# Altium schematic sheet Power_HST.SchDoc
size Tabloid
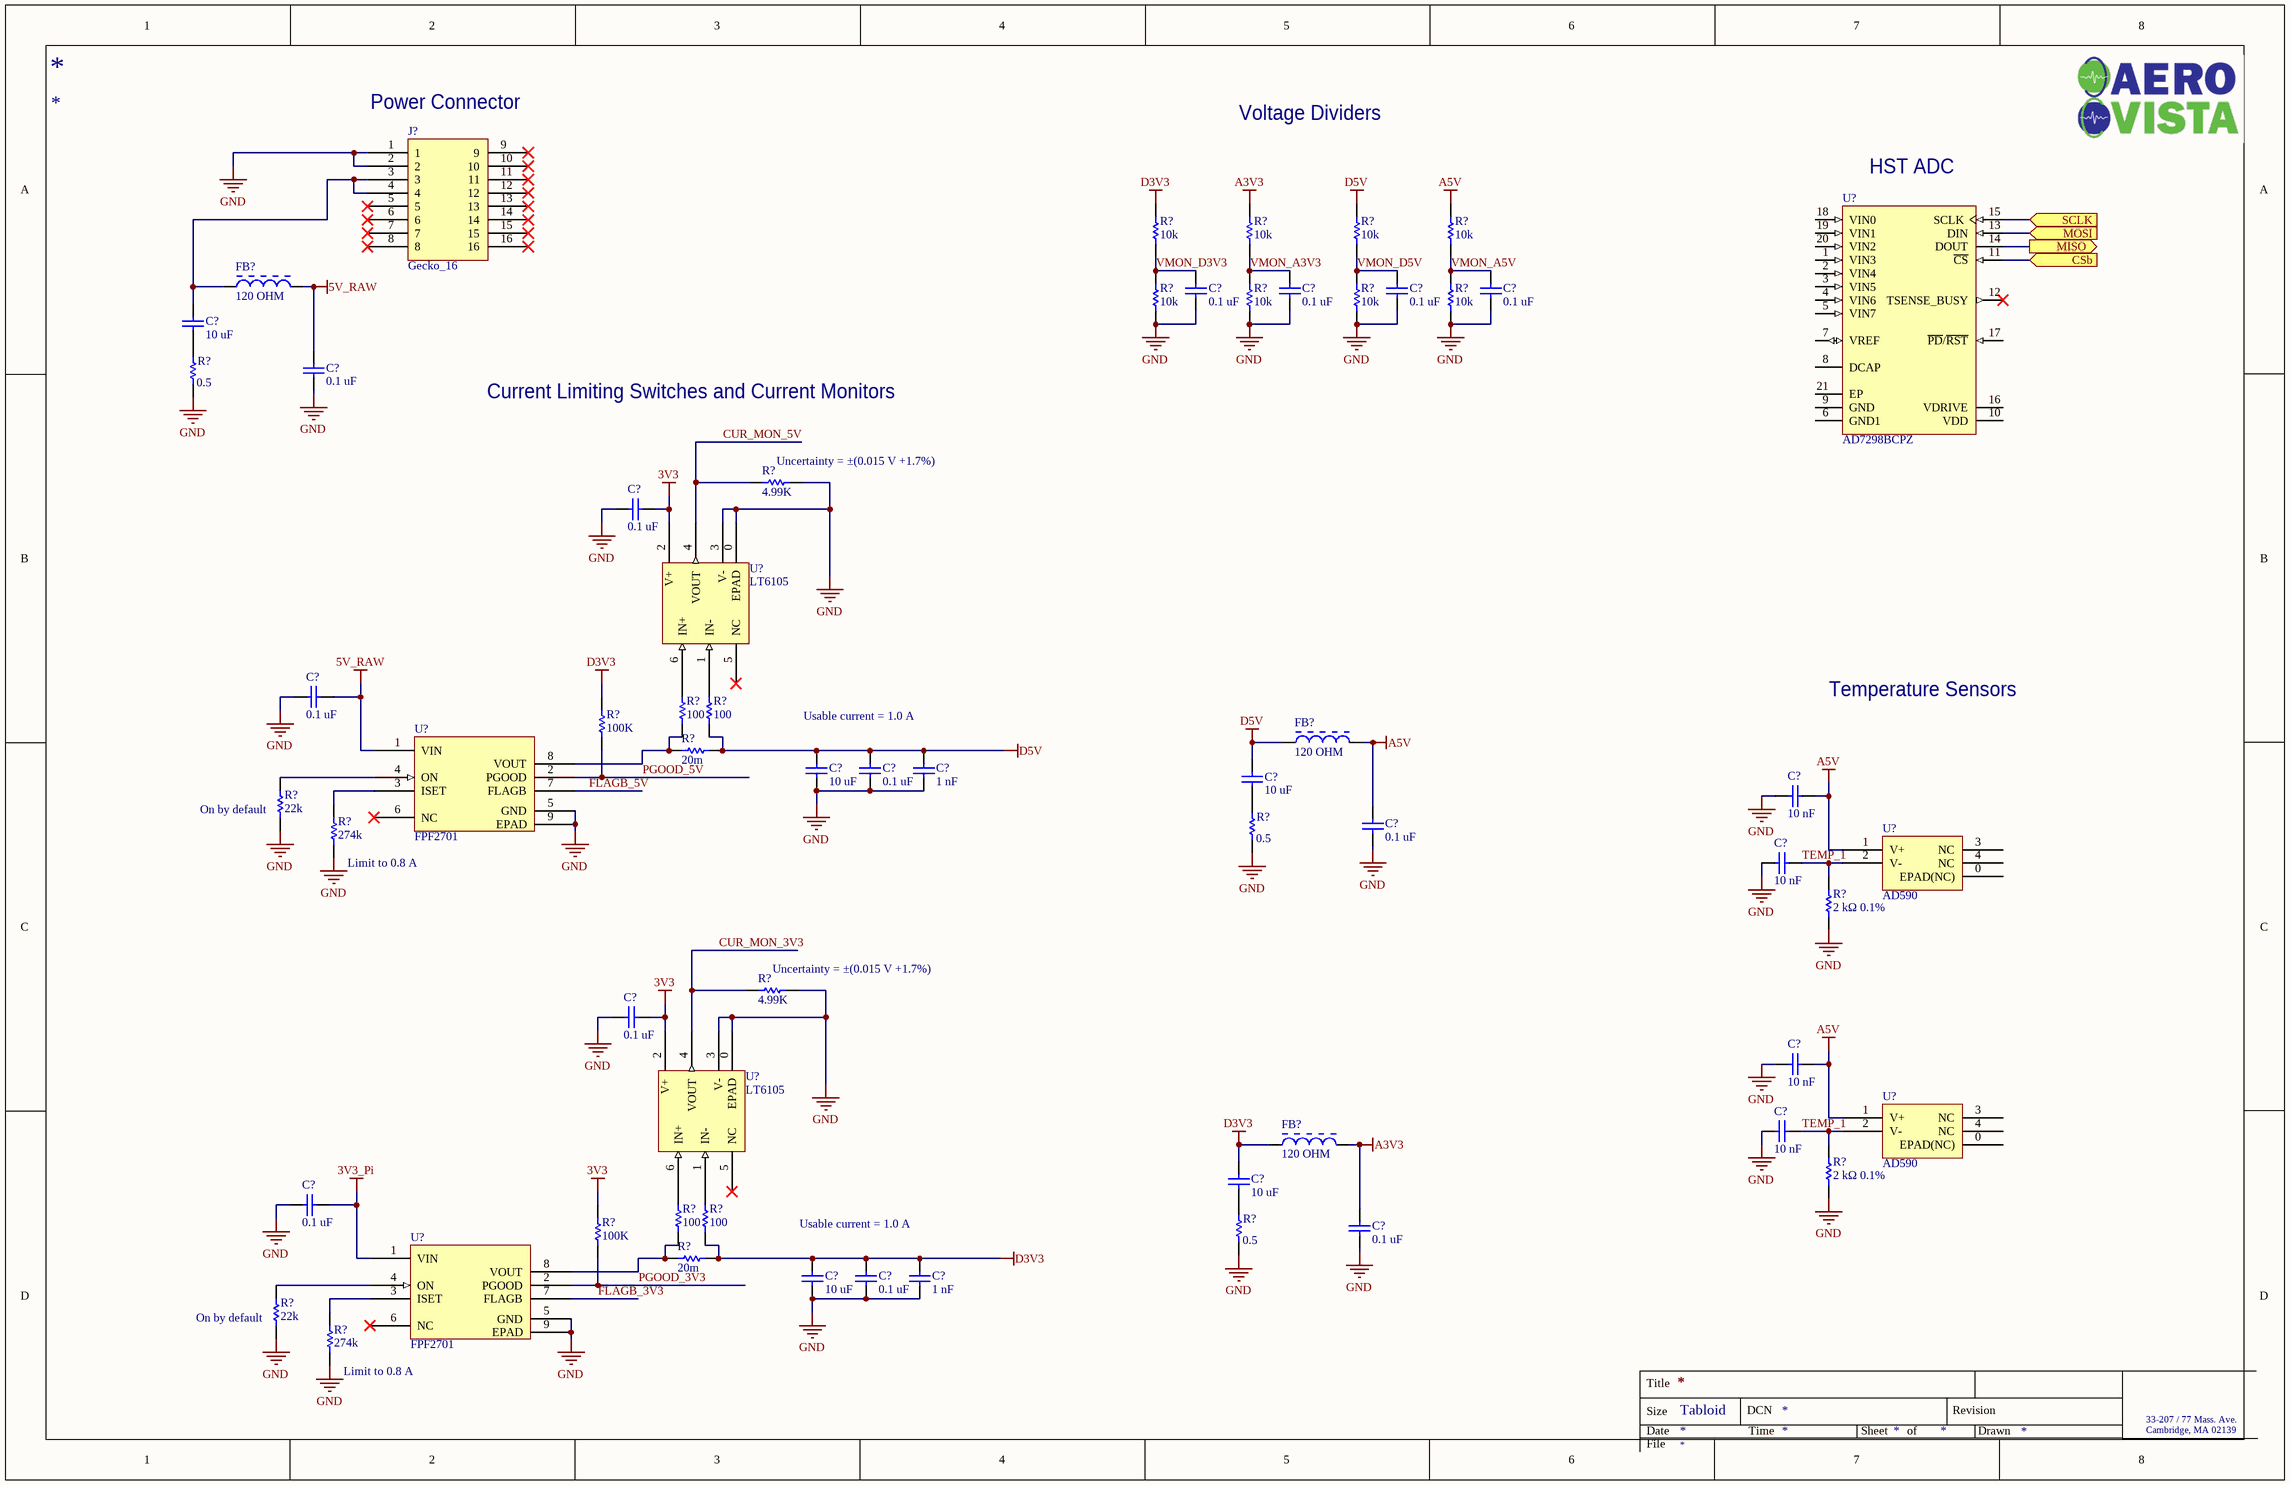
[diagram p0: Power_HST.SchDoc]

## Parts
(Parts that share a designator on the sheet are numbered #1, #2 ... from top to bottom, then left to right.)
C?#1  0.1 uF  [CAPC1005X55X25LL05T10]
C?#2  0.1 uF  [CAPC1005X55X25LL05T10]
C?#3  0.1 uF  [CAPC1005X55X25LL05T10]
C?#4  0.1 uF  [CAPC1005X55X25LL05T10]
C?#5  10 uF  [CAPC1608X90X20LL10]
C?#6  0.1 uF  [CAPC1005X55X25LL05T10]
C?#7  0.1 uF  [CAPC1005X55X25LL05T10]
C?#8  0.1 uF  [CAPC1005X55X25LL05T10]
C?#9  1 nF  [CAPC1005X55X30LL05T10]
C?#10  10 nF  [CAPC1005X56X25NL10T15]
C?#11  10 uF  [CAPC1608X90X20LL10]
C?#12  0.1 uF  [CAPC1005X55X25LL05T10]
C?#13  10 uF  [CAPC1608X90X20LL10]
C?#14  0.1 uF  [CAPC1005X55X25LL05T10]
C?#15  10 nF  [CAPC1005X56X25NL10T15]
C?#16  0.1 uF  [CAPC1005X55X25LL05T10]
C?#17  10 nF  [CAPC1005X56X25NL10T15]
C?#18  10 nF  [CAPC1005X56X25NL10T15]
C?#19  10 uF  [CAPC1608X90X20LL10]
C?#20  0.1 uF  [CAPC1005X55X25LL05T10]
C?#21  0.1 uF  [CAPC1005X55X25LL05T10]
C?#22  1 nF  [CAPC1005X55X30LL05T10]
C?#23  10 uF  [CAPC1608X90X20LL10]
C?#24  0.1 uF  [CAPC1005X55X25LL05T10]
FB?#1  120 OHM  [MURA-BLM21-H1-CHIP-2_V]
FB?#2  120 OHM  [MURA-BLM21-H1-CHIP-2_V]
FB?#3  120 OHM  [MURA-BLM21-H1-CHIP-2_V]
J?  Gecko_16
R?#1  10k  [RESC1005X40X25LL05T05]
R?#2  10k  [RESC1005X40X25LL05T05]
R?#3  10k  [RESC1005X40X25LL05T05]
R?#4  10k  [RESC1005X40X25LL05T05]
R?#5  10k  [RESC1005X40X25LL05T05]
R?#6  10k  [RESC1005X40X25LL05T05]
R?#7  10k  [RESC1005X40X25LL05T05]
R?#8  10k  [RESC1005X40X25LL05T05]
R?#9  0.5  [RESC1005X40X25LL10T10]
R?#10  4.99K  [RESC1005X40X25LL05T05]
R?#11  100  [RESC0402(1005)_L]
R?#12  100  [RESC0402(1005)_L]
R?#13  100K  [RESC1005X40X25LL05T05]
R?#14  20m  [RESC1608X55X25LL10T15]
R?#15  22k  [RESC1005X40X25LL05T05]
R?#16  0.5  [RESC1005X40X25LL10T10]
R?#17  274k  [RESC1005X40X25NL05T05]
R?#18  2 kΩ 0.1%  [RESC1005X40X25LL10T10]
R?#19  4.99K  [RESC1005X40X25LL05T05]
R?#20  2 kΩ 0.1%  [RESC1005X40X25LL10T10]
R?#21  100  [RESC0402(1005)_L]
R?#22  100  [RESC0402(1005)_L]
R?#23  0.5  [RESC1005X40X25LL10T10]
R?#24  100K  [RESC1005X40X25LL05T05]
R?#25  20m  [RESC1608X55X25LL10T15]
R?#26  22k  [RESC1005X40X25LL05T05]
R?#27  274k  [RESC1005X40X25NL05T05]
U?#1  AD7298BCPZ  [CP-20-8_M]
U?#2  LT6105  [QFN50P300X200X80_HS-7N]
U?#3  FPF2701  [QFN65P300X300X80_HS-9N]
U?#4  AD590
U?#5  AD590
U?#6  LT6105  [QFN50P300X200X80_HS-7N]
U?#7  FPF2701  [QFN65P300X300X80_HS-9N]

## Ports
CSb (in), MISO (out), MOSI (in), SCLK (in)

## Nets
3V3: C?#7.2 C?#16.2 R?#24.2 U?#2.2(V+) U?#6.2(V+)
3V3_Pi: C?#20.2 U?#7.1(VIN)
5V_RAW: C?#6.2 C?#8.2 FB?#1.2 U?#3.1(VIN)
A3V3: C?#21.2 FB?#3.2 R?#2.2
A5V: C?#10.2 C?#14.2 C?#17.2 FB?#2.2 R?#4.2 U?#4.1(V+) U?#5.1(V+)
D3V3: C?#19.2 C?#22.2 C?#23.2 C?#24.2 FB?#3.1 R?#1.2 R?#13.2 R?#22.1 R?#25.2
D5V: C?#9.2 C?#11.2 C?#12.2 C?#13.2 FB?#2.1 R?#3.2 R?#12.1 R?#14.2
GND: C?#1.1 C?#2.1 C?#3.1 C?#4.1 C?#6.1 C?#7.1 C?#8.1 C?#9.1 C?#10.1 C?#11.1 C?#12.1 C?#14.1 C?#15.1 C?#16.1 C?#17.1 C?#18.1 C?#20.1 C?#21.1 C?#22.1 C?#23.1 C?#24.1 J?.1 J?.2 R?#5.1 R?#6.1 R?#7.1 R?#8.1 R?#9.1 R?#10.2 R?#15.1 R?#16.1 R?#17.1 R?#18.1 R?#19.2 R?#20.1 R?#23.1 R?#26.1 R?#27.1 U?#2.0(EPAD) U?#2.3(V-) U?#3.5(GND) U?#3.9(EPAD) U?#6.0(EPAD) U?#6.3(V-) U?#7.5(GND) U?#7.9(EPAD)
CSb: U?#1.11(~{CS}) ; port CSb
CUR_MON_3V3: R?#19.1 U?#6.4(VOUT)
CUR_MON_5V: R?#10.1 U?#2.4(VOUT)
FLAGB_3V3: U?#7.7(FLAGB)
FLAGB_5V: U?#3.7(FLAGB)
MISO: U?#1.14(DOUT) ; port MISO
MOSI: U?#1.13(DIN) ; port MOSI
PGOOD_3V3: R?#24.1 U?#7.2(PGOOD)
PGOOD_5V: R?#13.1 U?#3.2(PGOOD)
SCLK: U?#1.15(SCLK) ; port SCLK
TEMP_1: C?#15.2 C?#18.2 R?#18.2 R?#20.2 U?#4.2(V-) U?#5.2(V-)
VMON_A3V3: C?#2.2 R?#2.1 R?#6.2
VMON_A5V: C?#4.2 R?#4.1 R?#8.2
VMON_D3V3: C?#1.2 R?#1.1 R?#5.2
VMON_D5V: C?#3.2 R?#3.1 R?#7.2
NetC?#5_1: C?#5.1 R?#9.2
NetC?#5_2: C?#5.2 FB?#1.1 J?.3 J?.4
NetC?#13_1: C?#13.1 R?#16.2
NetC?#19_1: C?#19.1 R?#23.2
NetR?#11_1: R?#11.1 R?#14.1 U?#3.8(VOUT)
NetR?#11_2: R?#11.2 U?#2.6(IN+)
NetR?#12_2: R?#12.2 U?#2.1(IN-)
NetR?#15_2: R?#15.2 U?#3.4(ON)
NetR?#17_2: R?#17.2 U?#3.3(ISET)
NetR?#21_1: R?#21.1 R?#25.1 U?#7.8(VOUT)
NetR?#21_2: R?#21.2 U?#6.6(IN+)
NetR?#22_2: R?#22.2 U?#6.1(IN-)
NetR?#26_2: R?#26.2 U?#7.4(ON)
NetR?#27_2: R?#27.2 U?#7.3(ISET)

Not connected (* = marked no-connect by the designer): J? 5* 6* 7* 8* 9* 10* 11* 12* 13* 14* 15* 16*; U?#1 1(VIN3) 2(VIN4) 3(VIN5) 4(VIN6) 5(VIN7) 6(GND1) 7(VREF) 8(DCAP) 9(GND) 10(VDD) 12(TSENSE_BUSY)* 16(VDRIVE) 17(~{PD}/~{RST}) 18(VIN0) 19(VIN1) 20(VIN2) 21(EP); U?#2 5(NC)*; U?#3 6(NC)*; U?#4 0(EPAD(NC)) 3(NC) 4(NC); U?#5 0(EPAD(NC)) 3(NC) 4(NC); U?#6 5(NC)*; U?#7 6(NC)*

## Notes on the sheet
- (near J?) Power Connector
- Voltage Dividers
- (near U?#1) HST ADC
- Current Limiting Switches and Current Monitors
- (near R?#10) Uncertainty = ±(0.015 V +1.7%)
- Temperature Sensors
- (near C?#11) Usable current = 1.0 A
- (near R?#15) On by default
- (near R?#17) Limit to 0.8 A
- (near R?#19) Uncertainty = ±(0.015 V +1.7%)
- (near C?#23) Usable current = 1.0 A
- (near R?#26) On by default
- (near R?#27) Limit to 0.8 A
- Title
- Size
- Date
- Tabloid
- DCN
- Time
- Sheet
- of
- Revision
- Drawn
- 33-207 / 77 Mass. Ave.
- Cambridge, MA 02139
- File

## Library data of the parts
C?#1-C?#4 C?#6-C?#8 C?#12 C?#14 C?#16 C?#20 C?#21 C?#24 = CMP-2100-03641-1: Chip Capacitor, 0.1 uF, +/- 10%, 16 V, -55 to 125 degC, 0402 (1005 Metric), RoHS, Tape and Reel; Manufacturer: Murata; Material: Ceramic; Insulation Resistance: 10GR; Voltage: 16V; Dielectric: X7R; Capacitance: 100nF; REACH SVHC: NoSVHC; Depth: 0.5mm; Case/Package: 0402; Datasheet URL: http://psearch.en.murata.com/capacitor/product/GRM155R71C104KA88%23.pdf; Lead Free: LeadFree; Dielectric Material: Ceramic; Manufacturer URL: http://www.murata.com/; Min Operating Temperature: -55degC; Length: 1mm; Case Code (Metric): 1005; Radiation Hardening: No; Package Reference: 0402; RoHSCompliant: true; Datasheet Version: 42675.0; Thickness: 0.022inch; Packaging: TapeandReel; Voltage Rating (DC): 16V; Tolerance: 10%; Max Operating Temperature: 125degC; Package Description: 2-Pin Surface Mount Device, Body 1 x 0.5 mm; Mount: SurfaceMount; Height: 0.5mm; Width: 0.5mm; Number of Pins: 2; Voltage Rating: 16V; Case Code (Imperial): 0402; Termination: SMD/SMT; Package Quantity: 1
C?#5 C?#11 C?#13 C?#19 C?#23 = CMP-2000-04979-1: Chip Capacitor, 10 uF, +/- 10%, 10 V, -55 to 85 degC, 0603 (1608 Metric), RoHS, Tape and Reel; PCN Part Number: MLCCPartNumberChange30/Nov/2012; Manufacturer: TDK; Temperature Coefficient: X5R; Product Training Modules: CSeriesGeneralApplicationsSEAT,CCV,andTVCLDesignToolsGuidetoReplacinganElectrolyticCapacitorwithanMLCC; Online Catalog: CSeries,GeneralPurpose; Voltage - Rated: 10V; Other Names: 445-7486-1; Capacitance: 10µF; Design Resources: 20WNon-IsolatedBuckLEDDriverUsingPLLNK460KG; Kits: 445-9003-KIT-ND-KITCAPCERHICAPMLCCSMD; Height - Seated (Max): -; Family: CeramicCapacitors; Package Description: 2-Pin Surface Mount Device, Body 1.6 x 0.8 mm; Category: Capacitors; Datasheet Version: Mar-15; RoHS Information: RoHSCertificate-MLCC; Thickness (Max): 0.035"(0.90mm); Operating Temperature: -55degC~85degC; Package Reference: 603; Series: C; Applications: GeneralPurpose; Datasheet URL: http://download.siliconexpert.com/pdfs/2015/4/21/15/54/45/779/tdk_/manual/37024850441143360mlcc_commercial_general_en.pdf; Features: -; Lead Style: -; Lead Spacing: -; Ratings: -; Size / Dimension: 0.063"Lx0.031"W(1.60mmx0.80mm); Tolerance: ±10%; Mounting Type: SurfaceMount,MLCC; Standard Package: 1; Package / Case: 0603(1608Metric); Manufacturer URL: http://www.tdk.com/; Packaging: CutTape(CT)
C?#9 C?#22 = CMP-2008-03058-1: Part Number: C0402C102K4RACTU; Manufacturer: Kemet
C?#10 C?#15 C?#17 C?#18 = CMP-2008-02912-1: Part Number: 0402ZC103KAT2A; Manufacturer: AVX Interconnect / Elco; Capacitance: 10 nF
FB?#1-FB?#3 = CMP-0686-00716-2: Chip Ferrite Bead for General Signal lines, 120 Ohm, 800 mA, -55 to 125 degC, 2 x 1.25 x 1.05 mm SMD, Tape and Reel; PartNumber: BLM21AG121SN1D; Manufacturer: Murata; Rated Current: 800 mA; DC Resistance: 0.1 Ohm Max.; Impedance (at 100 MHz): 120 Ohm +/- 25%; DatasheetVersion: 08/2013; PackageReference: BLM21_H1050-2; ComponentLink3URL: http://www.murata.com/products/catalog/pdf/c31e.pdf; Mounting Technology: Surface Mount; Operating Temperature Range: -55 to 125 degC; ComponentLink2Description: Datasheet; ComponentLink1URL: http://www.murata.com/; ComponentLink3Description: Package Specification; Packing: Tape and Reel; ComponentLink2URL: http://www.murata.com/products/catalog/pdf/c31e.pdf; PackageDescription: 2-Pin Chip, Body 2 x 1.25 mm; ComponentLink1Description: Manufacturer URL
R?#1-R?#8 = CMP-2002-08135-1: Manufacturer: Vishay Dale; Part Number: CRCW040210K0FKED
R?#9 R?#16 R?#23 = CMP-2002-06398-1: Part Number: RL0402FR-070R5L; Manufacturer: Yageo
R?#10 R?#19 = CMP-2002-00966-3: Chip Resistor, 4.99 KOhm, +/- 1%, 100 mW, -55 to 155 degC, 0402 (1005 Metric), RoHS, Tape and Reel; Manufacturer: Basic Passives; PartNumber: ERJ-2RKF4991X; Power Rating: 100 mW; Case\/Package: 0402; Voltage Rating: 50 V; REACH SVHC: Unknown; PackageDescription: 2-Pin Surface Mount Device, Body 1 x 0.5 mm; Mounting Technology: Surface Mount; ComponentLink2URL: http://industrial.panasonic.com/cdbs/www-data/pdf/RDA0000/AOA0000C86.pdf; Packaging: Tape and Reel; Case Code (Imperial): 0402; PackageReference: 0402; Min Operating Temperature: -55 degC; ComponentLink1URL: http://www.panasonic.com/; Width: 0.5 mm; Mount: Surface Mount; Max Operating Temperature: 155 degC; Radiation Hardening: No; Resistance: 4.99 KOhm; ComponentLink1Description: Manufacturer URL; Case Code (Metric): 1005; Pins: 2; Package Quantity: 10000; DatasheetVersion: 04/2015; ComponentLink2Description: Datasheet; Weight: 2.8E-05oz; Length: 1 mm; Tolerance: 1%; RoHSCompliant: true; Height: 0.35 mm
R?#11 R?#12 R?#21 R?#22 = CMP-1011-00397-1: 100R 0.063W 1% 0402 (1005 Metric)  SMD; Case-EIA: 0402; Case-Metric: 1005; Value: 100.00 Ohm; Technology: SMT; Tolerance: 1 %; Power: 0.063 W
R?#13 R?#24 = CMP-2002-08123-2: Chip Resistor, 100 KOhm, +/- 1%, 0.63 W, -55 to 155 degC, 0402 (1005 Metric), RoHS, Tape and Reel; Voltage Rating: 50 V; Type (Resistor): Thick Film; Power Rating: 63 mW; Case\Package: 0402; Mount: Surface Mount; Packaging: Tape and Reel; Weight: 2.3E-05 oz; PackageDescription: 2-Pin Surface Mount Device, Body 1 x 0.5 mm; ComponentLink1Description: Manufacturer URL; ComponentLink2Description: Datasheet; Min Operating Temperature: -55 degC; Width: 0.5 mm; Resistance: 100 kohm; REACH SVHC: Unknown; ComponentLink2URL: http://www.vishay.com/docs/20035/dcrcwe3.pdf; Package Quantity: 10000; Mounting Technology: Surface Mount; PackageReference: 0402; ComponentLink1URL: http://www.vishay.com/; Max Operating Temperature: 155 degC; Length: 1 mm; DatasheetVersion: 06/2012; Height: 0.35 mm; Case Code (Imperial): 0402; Pins: 2; Tolerance: 1%; Case Code (Metric): 1005; Radiation Hardening: No; RoHSCompliant: true
R?#14 R?#25 = CMP-2000-04331-1: Manufacturer: Yageo; Part Number: RL0603FR-070R02L
R?#15 R?#26 = CMP-2002-01133-1: Part Number: ERJ2RKF2202X; Manufacturer: Panasonic
R?#17 R?#27 = CMP-2002-08429-1: Part Number: CRCW0402274KFKED; Manufacturer: Vishay Dale
R?#18 R?#20 = CMP-2002-05790-1: Manufacturer: Panasonic; Part Number: ERA-2AEB202X; Resistance: 2 kΩ 0.1%
U?#1 = CMP-0313-00349-2: 8 Channel 12-Bit SAR Analog-to-Digital Converter with SPI Interface and Temperature Sensor 1MSPS, -40 to +125 degC, CP-20-8, Pb-Free, Tray; Manufacturer: Analog Devices; Generic Part Number: AD7298; Resolution (Bits): 12; Throughput Rate (SPS): 1M; Channels: 9; ComponentLink3URL: http://www.analog.com/static/imported-files/packages/PKG_PDF/LFCSP(CP)/CP-20/CP_20_8.pdf; PackageDescription: 20-Lead Lead Frame Chip Scale Package [LFCSP_WQ] 4 x 4 mm Body, Very Very Thin Quad; ComponentLink2URL: http://www.analog.com/static/imported-files/data_sheets/AD7298.pdf; Packing: Tray; PartNumber: AD7298BCPZ; ComponentLink4URL: http://www.analog.com/en/analog-to-digital-converters/ad-converters/ad7298/products/product.html; RoHS: Y; PackageReference: CP-20-8; PackageVersion: 020509-B; Mounting Technology: Surface Mount; ComponentLink3Description: Package Specification; DatasheetVersion: Rev.B; Code_JEDEC: MO-220-WGGD; ComponentLink2Description: Datasheet; ComponentLink4Description: Product URL; ComponentLink1Description: Manufacturer URL; ComponentLink1URL: http://www.analog.com/en/index.html; Interface: SPI
U?#3 U?#7 = FPF2701: Manufacturer 1: ON Semiconductor / Fairchild; Manufacturer Part Number 1: FPF2701MPX; Max Power Dissipation: 1.25W; Number of Inputs: 1; Output Current: 2A; On-State Resistance: 88mR; Interface: On/Off; Max Input Voltage: 36V; Min Input Voltage: 2.8V; Fault Protection: Over Temperature; Output Configuration: High Side; ComponentLink1Description: Datasheet; ComponentLink1URL: https://www.onsemi.com/pub/Collateral/FPF2702-D.pdf; Supplier 1: Avnet; Stock 1: 3000; Pricing 1: 3000=2.19054, 6000=1.20150, 12000=1.19260, 18000=1.18370, 24000=1.17480 (USD); RoHS: Yes; Mount: Surface Mount; Number of Pins: 8; Weight: 0.151g; Min Operating Temperature: -40°C; Max Operating Temperature: 85°C; Packaging: Tape and Reel; Package Quantity: 3000; Number of Outputs: 1; Max Output Current: 2A; Operating Supply Voltage: 36V; Length: 3mm; Height: 0.75mm; Width: 3mm; Radiation Hardening: No; REACH SVHC: No SVHC; Lead Free: Lead Free; ComponentLink2URL: https://datasheet.ciiva.com/4923/fpf2701-191159-4923264.pdf?src-supplier=Mouser; ComponentLink2Description: https://datasheet.ciiva.com/4923/fpf2701-191159-4923264.pdf?src-supplier=Mouser; ComponentLink3URL: https://datasheet.ciiva.com/15113/getdatasheetpartid-571901-15113998.pdf?src-supplier=Verical; ComponentLink3Description: https://datasheet.ciiva.com/15113/getdatasheetpartid-571901-15113998.pdf?src-supplier=Verical; ComponentLink4URL: https://datasheet.ciiva.com/15062/fpf2701-15062917.pdf?src-supplier=Digi-Key; ComponentLink4Description: https://datasheet.ciiva.com/15062/fpf2701-15062917.pdf?src-supplier=Digi-Key; ComponentLink5URL: https://datasheet.ciiva.com/1512/1785288-1512486.pdf?src-supplier=Element14; ComponentLink5Description: https://datasheet.ciiva.com/1512/1785288-1512486.pdf?src-supplier=Element14; ComponentLink6URL: https://datasheet.ciiva.com/3216/fpf2702-3216922.pdf?src-supplier=Avnet; ComponentLink6Description: https://datasheet.ciiva.com/3216/fpf2702-3216922.pdf?src-supplier=Avnet; ComponentLink7URL: https://datasheet.ciiva.com/25902/fpf2702-25902287.pdf?src-supplier=Avnet+Europe; ComponentLink7Description: https://datasheet.ciiva.com/25902/fpf2702-25902287.pdf?src-supplier=Avnet+Europe; ComponentLink8URL: https://datasheet.ciiva.com/48696/001252661-da-01-en-ic-load-switch-0-4-fpf2701mpx-mlp-8-fsc-48696074.pdf?src-supplier=Conrad; ComponentLink8Description: https://datasheet.ciiva.com/48696/001252661-da-01-en-ic-load-switch-0-4-fpf2701mpx-mlp-8-fsc-48696074.pdf?src-supplier=Conrad
U?#2 U?#6 = LT6105: ComponentLink1Description: Datasheet; ComponentLink1URL: https://www.analog.com/media/en/technical-documentation/data-sheets/6105fa.pdf